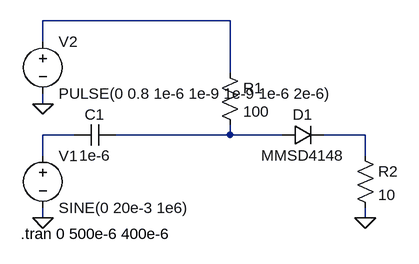
[diagram p0: schematic diodo.asc]
diodo.asc, the LTspice schematic file:
Version 4
SHEET 1 880 680
WIRE 128 -32 -160 -32
WIRE -160 0 -160 -32
WIRE 128 48 128 -32
WIRE -160 96 -160 80
WIRE -112 144 -160 144
WIRE 128 144 128 128
WIRE 128 144 -48 144
WIRE 208 144 128 144
WIRE 336 144 272 144
WIRE -160 176 -160 144
WIRE 336 176 336 144
WIRE -160 272 -160 256
WIRE 336 272 336 256
FLAG -160 96 0
FLAG -160 272 0
FLAG 336 272 0
SYMBOL diode 208 160 R270
WINDOW 0 32 32 VTop 2
WINDOW 3 0 32 VBottom 2
SYMATTR InstName D1
SYMATTR Value MMSD4148
SYMBOL res 112 32 R0
SYMATTR InstName R1
SYMATTR Value 100
SYMBOL res 320 160 R0
SYMATTR InstName R2
SYMATTR Value 10
SYMBOL cap -48 128 R90
WINDOW 0 0 32 VBottom 2
WINDOW 3 32 32 VTop 2
SYMATTR InstName C1
SYMATTR Value 1e-6
SYMBOL voltage -160 160 R0
WINDOW 123 0 0 Left 0
WINDOW 39 0 0 Left 0
SYMATTR InstName V1
SYMATTR Value SINE(0 20e-3 1e6)
SYMBOL voltage -160 -16 R0
WINDOW 123 0 0 Left 0
WINDOW 39 0 0 Left 0
SYMATTR InstName V2
SYMATTR Value PULSE(0 0.8 1e-6 1e-9 1e-9 1e-6 2e-6)
TEXT -194 296 Left 2 !.tran 0 500e-6 400e-6

The netlist it stands for:
* diodo.asc
D1 N003 N004 MMSD4148
R1 N001 N003 100
R2 N004 0 10
C1 N003 N002 1e-6
V1 N002 0 SINE(0 20e-3 1e6)
V2 N001 0 PULSE(0 0.8 1e-6 1e-9 1e-9 1e-6 2e-6)
.model D D
.lib standard.dio
.tran 0 500e-6 400e-6
.backanno
.end